# EAGLE design mp3412-boost-driver-mk-1.0 (EAGLE 7.5.0)
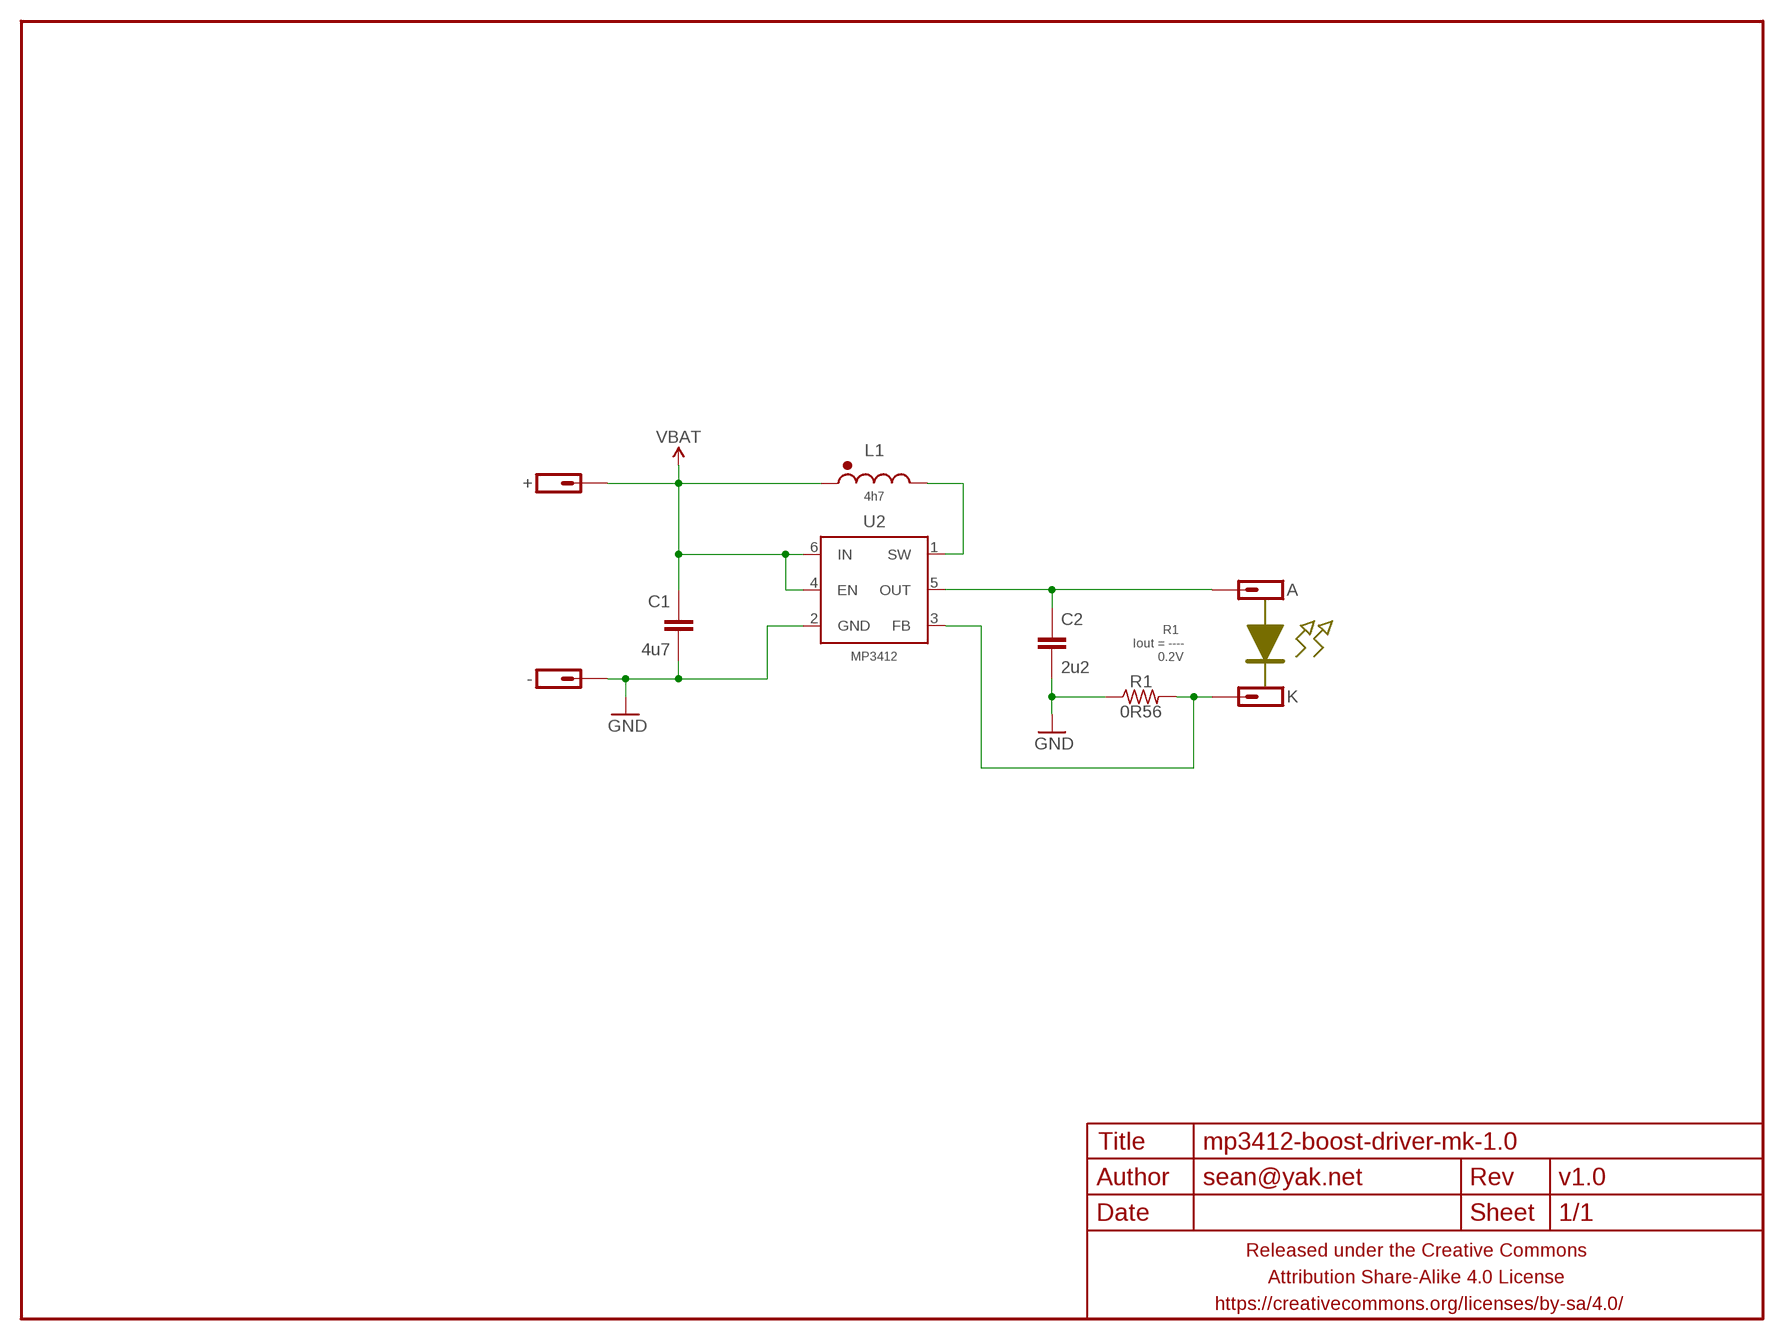
[diagram p0: schematic, sheet 1]

## Parts
+  M01NOT-A-VIA-NOPE  [1X01_NOSILK_NOSTOP]
-  M01NOT-A-VIA-NOPE  [1X01_NOSILK_NOSTOP]
A  M01PTH-1MM-CIR-NS  [1X01-1MM-CIR-NS]
C1  4u7  CAPACITOR-CERAMICC0603-TIGHTER  [C0603-TIGHTER]
C2  2u2  CAPACITOR-CERAMICC0603-TIGHTER  [C0603-TIGHTER]
FRAME1  FRAME-LETTERNO_PACKAGE  [DUMMY]
K  M01PTH-1MM-CIR-NS  [1X01-1MM-CIR-NS]
L1  4h7  INDUCTOREPL2014  [EPL2014]
R1  0R56  RESISTORR0603-TIGHTER  [R0603-TIGHTER]
U2  MP3412  [TSOT-23-6]

## Nets
GND: -.P$1 C1.2 C2.2 R1.1 U2.2(GND)
N$1: L1.P$2 U2.1(SW)
N$2: A.1 C2.1 U2.5(OUT)
N$3: K.1 R1.2 U2.3(FB)
VBAT: +.P$1 C1.1 L1.P$1 U2.4(EN) U2.6(IN)

## Notes on the sheet
- R1
  Iout = ----
         0.2V

## Library data of the parts
+ - A K = a_parts:M01: Header 1 Standard 1-pin 0.1" header. Use with straight break away headers (SKU : PRT-00116), right angle break away headers (PRT-00553), swiss pins (PRT-00743), machine pins (PRT-00117), and female headers (PRT-00115).
C1 C2 = a_parts:CAPACITOR-CERAMIC: CAPACITOR, European symbol
FRAME1 = a_parts:FRAME-LETTER: Schematic Frame Standard 8.5x11 US Letter frame; DESIGNER: sean@yak.net; VERSION: v1.0
L1 = a_parts:INDUCTOR: Inductors Basic Inductor/Choke - 0603 and 1206. Footprints are not proven and vary greatly between part numbers. SRN6045- 33uH, 20% 1.4A SDR0403-560KL - 56uH, 10%, 500mA RMS/740mA peak
R1 = a_parts:RESISTOR: RESISTOR, American symbol
U2 = a_parts:MP3412

## Board
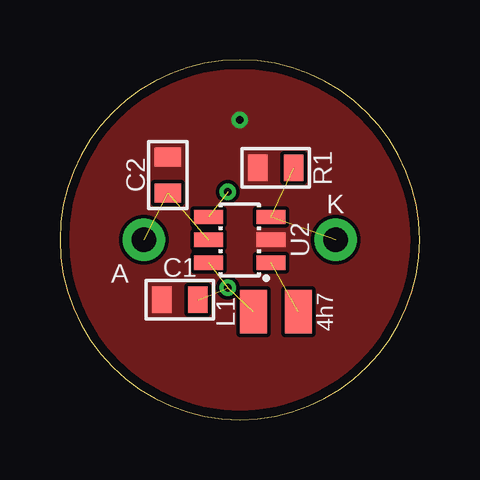
[diagram p1: board, top side]
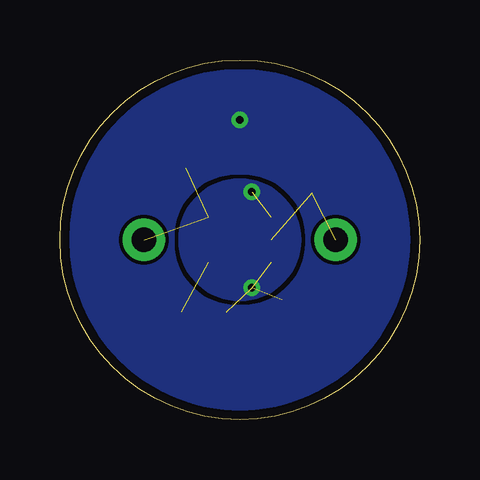
[diagram p2: board, bottom side, seen from below]

Size 15 x 15 mm. Coordinates in mm from the lower left corner, seen from the top.
Outline: 0,7.5 arc180 15,7.5 arc180 0,7.5
Copper layers (1*16): Top 0.0356mm / dielectric 1.5011mm / Bottom 0.0356mm
Design rules "LaenPCBOrder2": minimum track width 6mil, minimum drill 13mil, track to track 6mil, track to pad 6mil, pad to pad 6mil, via to via 6mil, smd to smd 6mil, copper to edge 15mil, drill to drill 6mil, minimum pad ring 7mil, minimum via ring 7mil, stop-mask expansion 3mil, vias tented up to drill 20mil, thermal gap 10mil

### Footprints (pad centres in the part's own frame; a part is rotated, then mirrored left to right if it is on the bottom)
1X01_NOSILK_NOSTOP = drill 0.33: P$1 0,0
1X01-1MM-CIR-NS = drill 1.016 pad 1.778: 1 0,0
C0603-TIGHTER = smd 0.8 x 1.1: 1 -0.75,0; 2 0.75,0
EPL2014 = smd 1.125 x 1.8: P$1 -0.938,0; P$2 0.938,0
R0603-TIGHTER = smd 0.8 x 1.1: 1 -0.75,0; 2 0.75,0
TSOT-23-6 = smd 0.6 x 1.2: 1 -0.95,-1.3; 2 0,-1.3; 3 0.95,-1.3; 4 0.95,1.3; 5 0,1.3; 6 -0.95,1.3

### Placement (x,y rotation side)
+  7,5.5 0 bottom
-  7.5,12.5 90 bottom
A  3.5,7.5 180 top
C1  5,5 180 top
C2  4.5,10.2 90 top
FRAME1  0,0 0 top
K  11.5,7.5 0 top
L1  9,4.5 0 top
R1  9,10.5 0 top
U2  7.5,7.5 90 top

### Tracks (layer width: path | path; a pad name or v marks a point on that pad's centre or on a via)
GND
  pour Top (isolate 0.152, rank 6, no thermals): 0,0 0,15 15,15 15,0
  pour Bottom (isolate 0.152, rank 6, no thermals): 0,15 0,0 15,0 15,15
N$1  (1 unrouted)
N$2  (2 unrouted)
N$3  (2 unrouted)
VBAT  (via drill 0.33)  (4 unrouted)
  other vias: 7,9.5
  pour Bottom (isolate 0.152, no thermals): 7.5,5 arc-90 5,7.5 arc-90 7.5,10 arc-90 10,7.5 arc-90